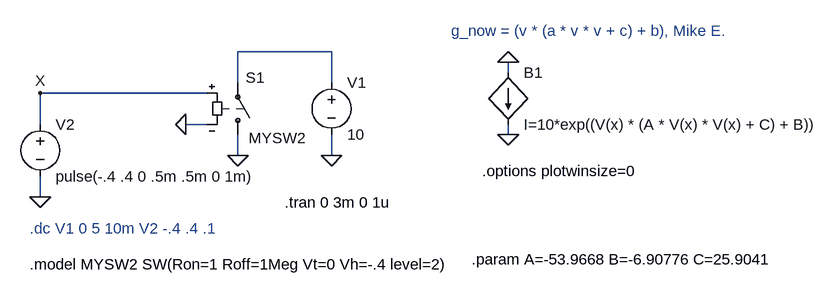
[diagram p0: schematic Vswitch2.asc]
Vswitch2.asc, the LTspice schematic file:
Version 4
SHEET 1 1296 680
WIRE 384 144 240 144
WIRE 656 176 656 160
WIRE 240 192 240 144
WIRE 384 192 384 144
WIRE 192 208 -64 208
WIRE -64 256 -64 208
WIRE 192 256 160 256
WIRE 656 272 656 256
WIRE 240 304 240 272
WIRE 384 304 384 272
WIRE -64 368 -64 336
FLAG -64 368 0
FLAG 384 304 0
FLAG 240 304 0
FLAG 160 256 0
FLAG 656 160 0
FLAG 656 272 0
FLAG -64 208 X
SYMBOL voltage 384 176 R0
SYMATTR Value 10
SYMATTR InstName V1
SYMBOL sw 240 288 M180
WINDOW 0 12 104 Left 2
WINDOW 3 17 11 Left 2
SYMATTR InstName S1
SYMATTR Value MYSW2
SYMBOL voltage -64 240 R0
SYMATTR InstName V2
SYMATTR Value pulse(-.4 .4 0 .5m .5m 0 1m)
SYMBOL bi 656 176 R0
SYMATTR InstName B1
SYMATTR Value I=10*exp((V(x) * (A * V(x) * V(x) + C) + B))
TEXT -80 416 Left 2 ;.dc V1 0 5 10m V2 -.4 .4 .1
TEXT -80 472 Left 2 !.model MYSW2 SW(Ron=1 Roff=1Meg Vt=0 Vh=-.4 level=2)
TEXT 312 376 Left 2 !.tran 0 3m 0 1u
TEXT 600 464 Left 2 !.param A=-53.9668 B=-6.90776 C=25.9041
TEXT 568 112 Left 2 ;g_now = (v * (a * v * v + c) + b), Mike E.
TEXT 616 328 Left 2 !.options plotwinsize=0

The netlist it stands for:
* Vswitch2.asc
V1 N001 0 10
S1 0 N001 X 0 MYSW2
V2 X 0 pulse(-.4 .4 0 .5m .5m 0 1m)
B1 0 0 I=10*exp((V(x) * (A * V(x) * V(x) + C) + B))
* .dc V1 0 5 10m V2 -.4 .4 .1
.model MYSW2 SW(Ron=1 Roff=1Meg Vt=0 Vh=-.4 level=2)
.tran 0 3m 0 1u
.param A=-53.9668 B=-6.90776 C=25.9041
* g_now = (v * (a * v * v + c) + b), Mike E.
.options plotwinsize=0
.backanno
.end